# Altium project badkamerElectronica.PrjPCB
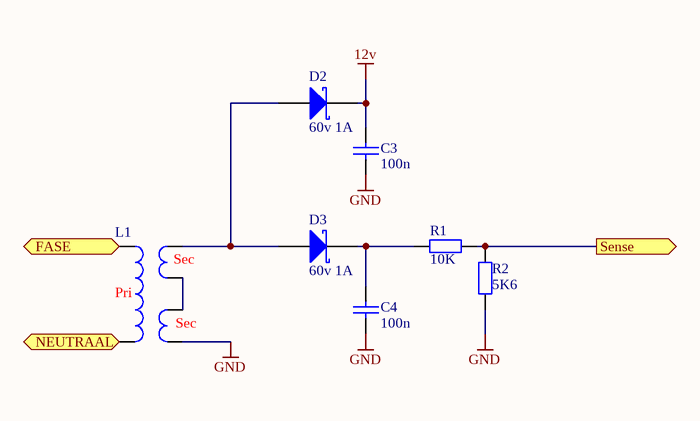
[diagram p0: schakelaarDetectie.SchDoc]
2 sheets, 12 parts. Net scope: strictly hierarchical (ports join the sheet entries above them; power ports are local).
Board file: pcb.PcbDoc
Sheets:
  schakelaarDetectie.SchDoc
  FET PWM output.SchDoc

## Sheet schakelaarDetectie.SchDoc
size A; DocumentNumber: 2; SheetNumber: 2; SheetTotal: 4

### Parts
C3  100n  [C0805]
C4  100n  [C0805]
D2  60v 1A  [SOD323]
D3  60v 1A  [SOD323]
L1  transformer_dual_output  [transformer_Block_1.5VA]  (value not drawn)
R1  value 10K  [R0805]  (hidden comment: RESISTOR)
R2  value 5K6  [R0805]  (hidden comment: RESISTOR)

### Ports
FASE (in), NEUTRAAL (in), Sense (out)

### Nets
12v: C3.2 D2.2
GND: C3.1 C4.1 L1.3 R2.2
NetC4_2: C4.2 D3.2 R1.1
NetD2_1: D2.1 D3.1 L1.6
NetL1_1: L1.1 ; port NEUTRAAL
NetL1_2: L1.2 ; port FASE
NetL1_4: L1.4 L1.5
NetR1_2: R1.2 R2.1 ; port Sense

### Notes on the sheet
- (in symbol transformer_220VAC) Sec; Pri

### Library data of the parts
C3 C4 = 100n: Voltage: 50v; Type: generic; Tolerance: 0.1; LatestRevision Note: Initial Release; Part Number: 100n; Value: 100n; Package: 0805; Component Type: Standard; LatestRevision Date: 31-Jul-10; Author: Willy Pietersz; Supplier 2: Digi-Key; Supplier Part Number 2: 478-1395-1-ND; ComponentLink1Description: Manufacturer; ComponentLink2Description: Datasheet
D2 D3 = PMEG6010CEJ: LatestRevision Note: Initial Release; Part Number: PMEG6010CEJ; Voltage: 60V; Current: 1A; Type: Schottky; Package: SOD123F; Component Type: Standard; LatestRevision Date: 29-Sep-10 09:43:01; Author: Willem Pietersz; ROHS: Y; Supplier 1: Farnell; Supplier 2: Digi-key; Supplier Part Number 2: 568-4138-1-ND; ComponentLink2Description: Datasheet; ComponentLink2URL: http://www.nxp.com/documents/data_sheet/PMEG6010CEH_PMEG6010CEJ.pdf
L1 = transformer_220VAC: Inductor; Value: 220VAC to 2x 12v; Part Number: transformer_220VAC; Supplier 1: Farnell; Supplier Part Number 1: 1131628
R1 = 10K: Manufacturer 1: Panasonic; Manufacturer 1 Part No: ERJT06J103V; Power: 0.25W; Tolerance: 0.05; LatestRevision Note: Initial Release; Published: 8-Jun-2000; LatestRevisionDate: 17-Jul-2002; LatestRevisionNote: Re-released for DXP Platform.; PackageReference: AXIAL-0.4; Publisher: Altium Limited; Part Number: 10K; Type: Film; Package: 0805; Component Type: Standard; LatestRevision Date: 30-Jul-10; Author: Willy Pietersz; ROHS: Y; Supplier 1: Farnell; Supplier Part Number 1: 1618242; ComponentLink1Description: Manufacturer; ComponentLink2Description: Datasheet
R2 = 5K6: Manufacturer 1: Panasonic; Manufacturer 1 Part No: ERJT06J562V; Power: 0.25W; Tolerance: 0.05; LatestRevision Note: Initial Release; Published: 8-Jun-2000; LatestRevisionDate: 17-Jul-2002; LatestRevisionNote: Re-released for DXP Platform.; PackageReference: AXIAL-0.4; Publisher: Altium Limited; Part Number: 5K6; Type: Film; Package: 0805; Component Type: Standard; LatestRevision Date: 30-Jul-10; Author: Willy Pietersz; ROHS: Y; Supplier 1: Farnell; Supplier Part Number 1: 1577375; ComponentLink1Description: Manufacturer; ComponentLink2Description: Datasheet

## Sheet FET PWM output.SchDoc
size A; DocumentNumber: 4; SheetNumber: 4; SheetTotal: 4
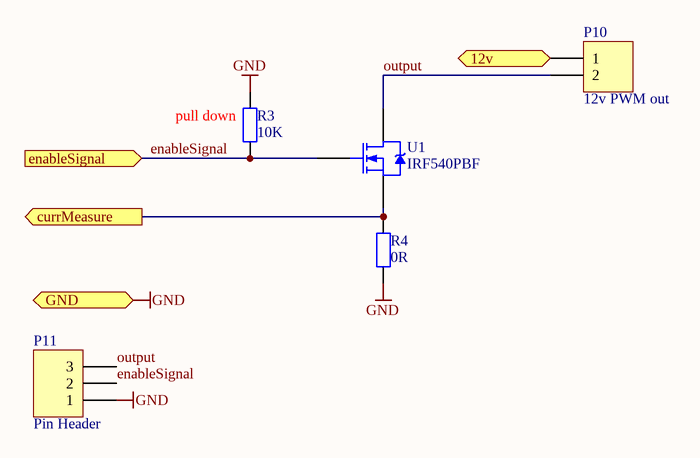
[diagram p1: FET PWM output.SchDoc]

### Parts
P10  12v PWM out  [TB2_5.08]
P11  Pin Header  [PH1x3_2.54]
R3  value 10K  [R0805]  (hidden comment: RESISTOR)
R4  value 0R  [R0805]  (hidden comment: RESISTOR)
U1  IRF540PBF  [TO-220AB]

### Ports
12v, currMeasure (out), enableSignal (in), GND

### Nets
GND: P11.1 R3.1 R4.2 ; port GND
enableSignal: P11.2 R3.2 U1.1(G) ; port enableSignal
output: P10.2 P11.3 U1.2(D)
NetP10_1: P10.1 ; port 12v
NetR4_1: R4.1 U1.3(S) ; port currMeasure

### Notes on the sheet
- (near R3) pull down

### Library data of the parts
P10 = TB2: Con1x2; Part Number: TB2; Current: 10; Voltage: 300; Pitch: 5.08; LatestRevision Note: Initial Release; Type: Terminal Block; Number Of Pins: 2; Component Type: Standard; LatestRevision Date: 23-Nov-10; Author: Bram van Rensen
P11 = PH1x3: Con1x3; Part Number: PH1x3; Pitch: 2.54; LatestRevision Note: Initial Release; Type: Pin Header; Number Of Pins: 3; Component Type: Standard; LatestRevision Date: 23-Nov-10; Author: Willy Pietersz; Supplier 1: Farnell
R3 = 10K: as R1 on sheet schakelaarDetectie; Published: 8-Jun-2000; LatestRevisionDate: 17-Jul-2002; LatestRevisionNote: Re-released for DXP Platform.; PackageReference: AXIAL-0.4; Publisher: Altium Limited; Part Number: 10K; Type: Film; Package: 0805; Component Type: Standard; LatestRevision Date: 30-Jul-10; Author: Willy Pietersz; ROHS: Y; Supplier 1: Farnell; Supplier Part Number 1: 1618242; ComponentLink1Description: Manufacturer; ComponentLink2Description: Datasheet
R4 = 0R: Published: 8-Jun-2000; LatestRevisionDate: 17-Jul-2002; LatestRevisionNote: Re-released for DXP Platform.; PackageReference: AXIAL-0.4; Publisher: Altium Limited; Part Number: 0R; Package: 0805; Component Type: Standard; Supplier 1: Farnell; Supplier Part Number 1: 1469846
U1 = IRF540PBF: Transistor; Manufacturer 1: IRF; Ron: 0.077; Current: 28; Voltage: 100; LatestRevision Note: Initial Release; Part Number: IRF540PBF; Type: NMOS; Component Type: Standard; LatestRevision Date: 31-7-2010; Author: Willy Pietersz; ROHS: Y; Manufacturer 1 Part No: IRF540PBF; Supplier 1: Farnell; Supplier Part Number 1: 1653661; ComponentLink1Description: Manufacturer; ComponentLink1URL: http://www.irf.com; ComponentLink2Description: Datasheet; ComponentLink2URL: http://www.vishay.com/docs/91021/91021.pdf